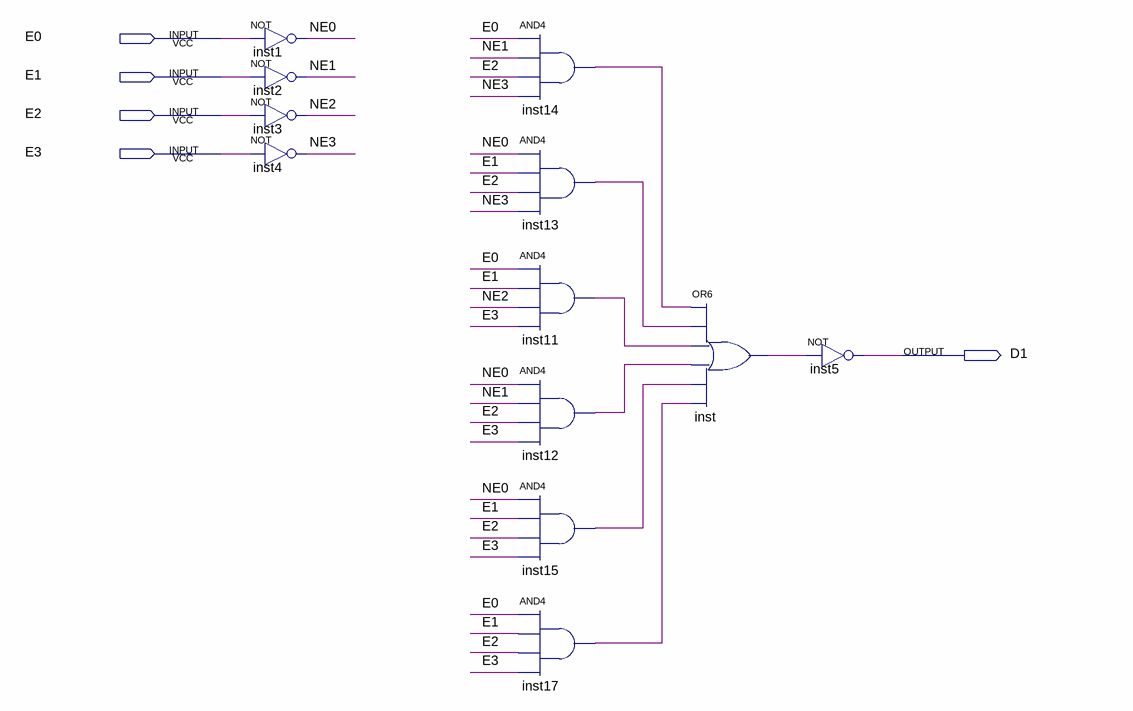
[diagram p0: schematic sheet]
// Quartus schematic D1.bdf as structural Verilog: 12 symbols, 5 pins
module D1 (
  input  E0,
  input  E1,
  input  E2,
  input  E3,
  output D1
);

  wire inst11_out, inst12_out, inst13_out, inst14_out, inst15_out, inst17_out, inst_out, NE0, NE1, NE2, NE3;

  not inst1 (NE0, E0);
  not inst2 (NE1, E1);
  not inst3 (NE2, E2);
  not inst4 (NE3, E3);
  and inst14 (inst14_out, E0, NE1, E2, NE3);
  and inst13 (inst13_out, NE0, E1, E2, NE3);
  and inst11 (inst11_out, E0, E1, NE2, E3);
  and inst12 (inst12_out, NE0, NE1, E2, E3);
  and inst15 (inst15_out, NE0, E1, E2, E3);
  and inst17 (inst17_out, E0, E1, E2, E3);
  or inst (inst_out, inst14_out, inst13_out, inst11_out, inst12_out, inst15_out, inst17_out);
  not inst5 (D1, inst_out);
endmodule
